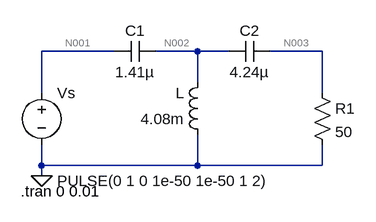
[diagram p0: schematic (2)ButHPF.asc]
(2)ButHPF.asc, the LTspice schematic file:
Version 4
SHEET 1 880 680
WIRE 112 48 0 48
WIRE 240 48 176 48
WIRE 288 48 240 48
WIRE 432 48 352 48
WIRE 240 96 240 48
WIRE 0 112 0 48
WIRE 432 112 432 48
WIRE 0 224 0 192
WIRE 240 224 240 176
WIRE 240 224 0 224
WIRE 432 224 432 192
WIRE 432 224 240 224
WIRE 0 240 0 224
FLAG 0 240 0
SYMBOL voltage 0 96 R0
WINDOW 123 24 124 Left 2
WINDOW 39 0 0 Left 2
WINDOW 3 24 152 Left 2
SYMATTR InstName Vs
SYMATTR Value PULSE(0 1 0 1e-50 1e-50 1 2)
SYMBOL ind 256 192 R180
WINDOW 0 36 80 Left 2
WINDOW 3 36 40 Left 2
SYMATTR InstName L
SYMATTR Value 4.08m
SYMBOL res 416 96 R0
SYMATTR InstName R1
SYMATTR Value 50
SYMBOL cap 352 32 R90
WINDOW 0 0 32 VBottom 2
WINDOW 3 32 32 VTop 2
SYMATTR InstName C2
SYMATTR Value 4.24µ
SYMBOL cap 176 32 R90
WINDOW 0 0 32 VBottom 2
WINDOW 3 32 32 VTop 2
SYMATTR InstName C1
SYMATTR Value 1.41µ
TEXT -32 264 Left 2 !.tran 0 0.01

The netlist it stands for:
* (2)ButHPF.asc
Vs N001 0 PULSE(0 1 0 1e-50 1e-50 1 2)
L 0 N002 4.08m
R1 N003 0 50
C2 N003 N002 4.24µ
C1 N002 N001 1.41µ
.tran 0 0.01
.backanno
.end

* Results of the author's LTspice run, read from the files saved beside the schematic
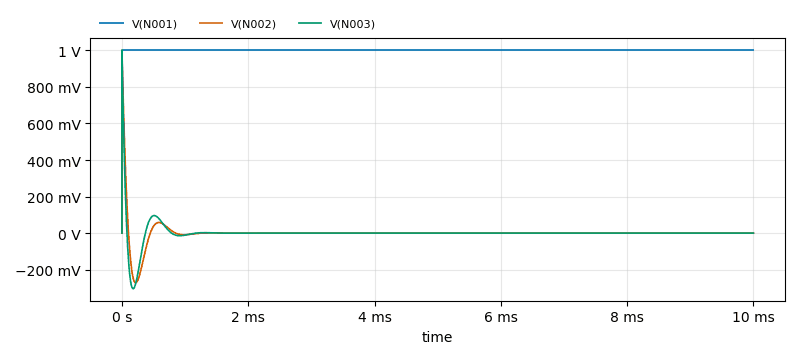
[diagram p1: Transient Analysis of (2)ButHPF.asc, plotted from the saved traces]
* Transient Analysis, 1 run:
*   V(N001): min 0 V, max 1 V, average 1 V, rms 1 V, last 1 V
*   V(N002): min -272.4 mV, max 1 V, average 31.49 µV, rms 63.3 mV, last 0 V
*   V(N003): min -304.9 mV, max 1 V, average 40.4 µV, rms 59.69 mV, last 0 V